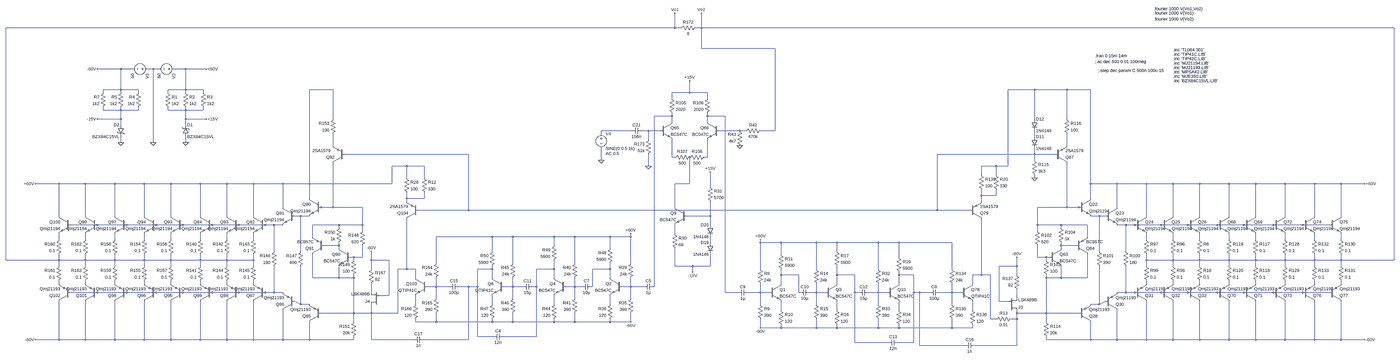
[diagram p0: schematic testV11.asc, whole sheet]
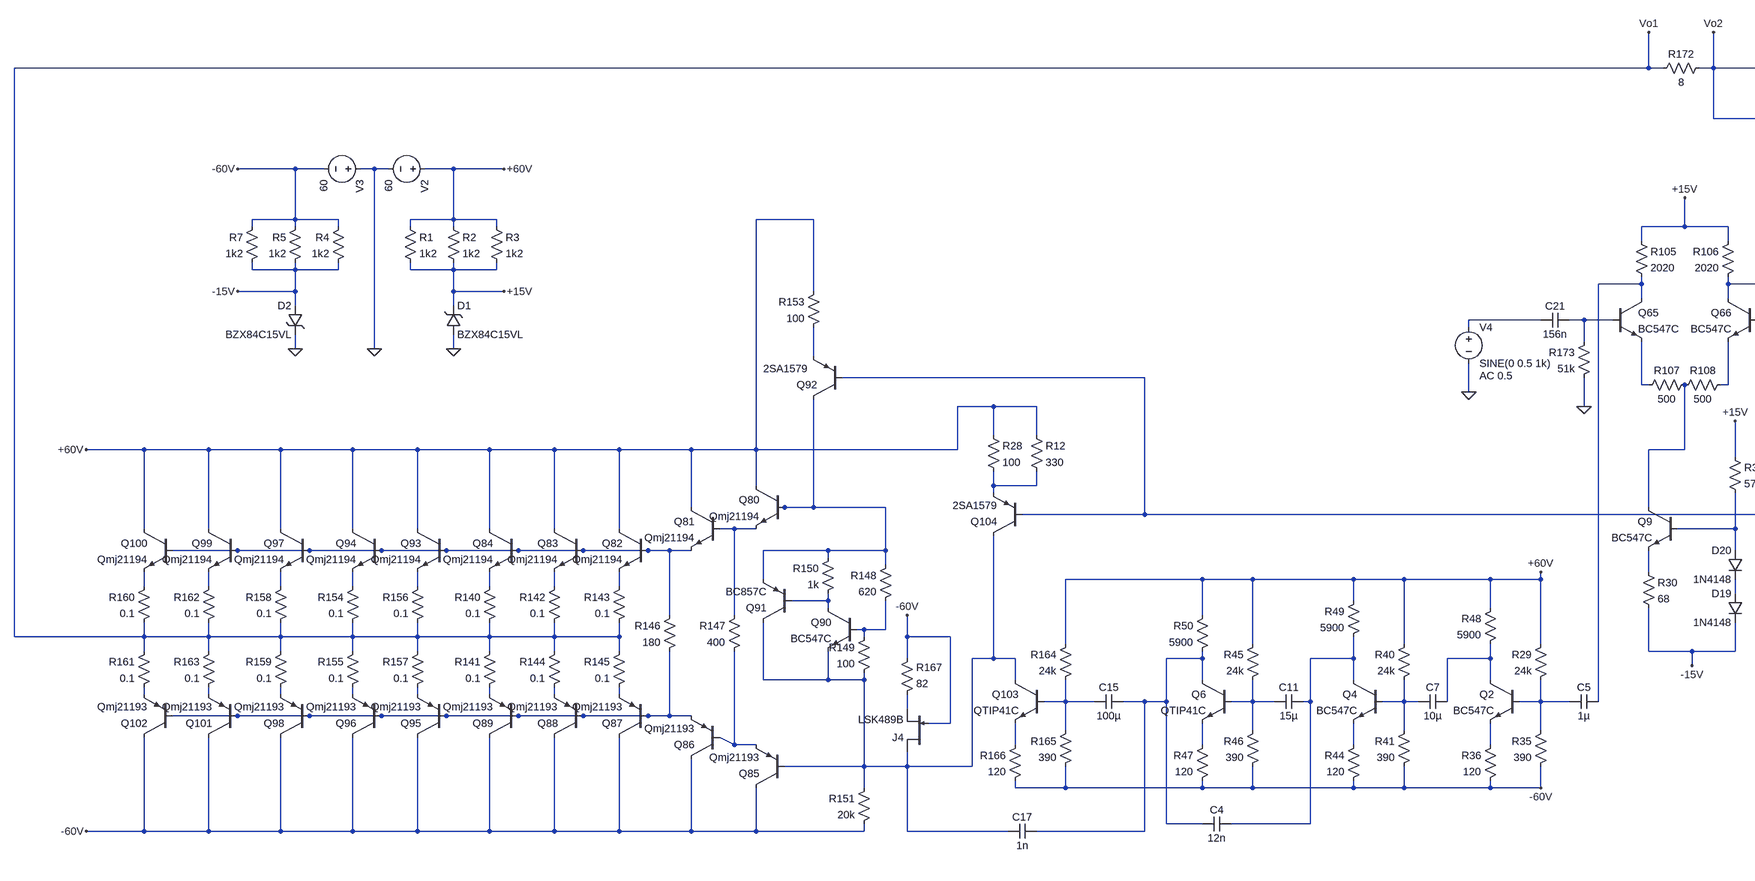
[diagram p1: schematic testV11.asc, part, row 1 of 1, column 1 of 2]
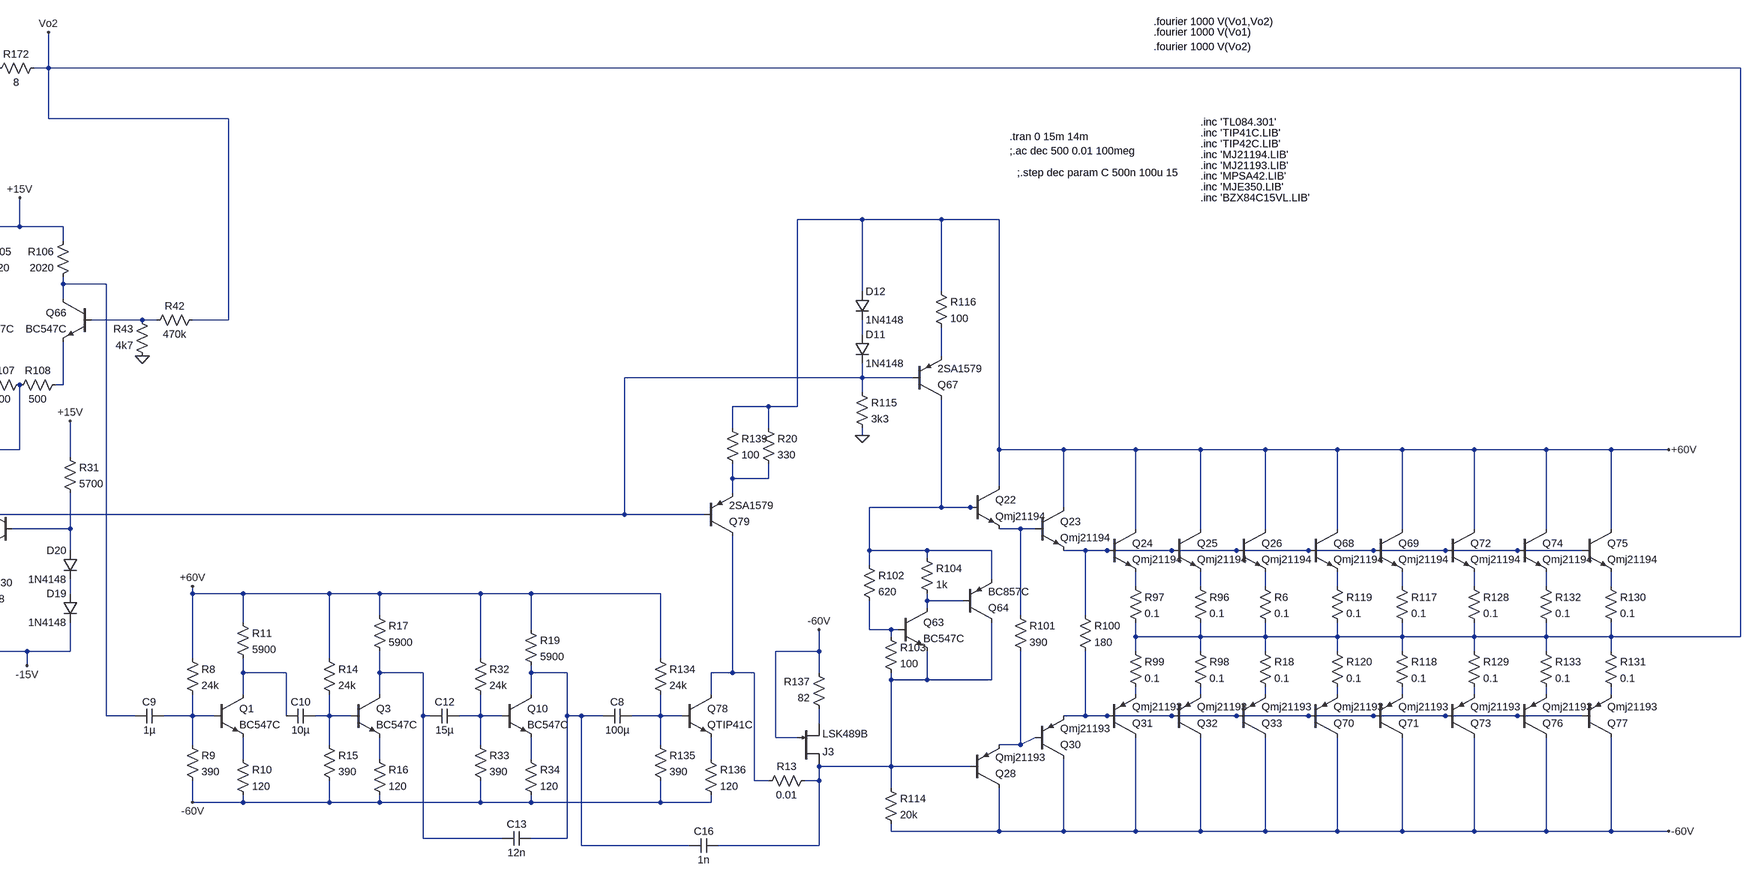
[diagram p2: schematic testV11.asc, part, row 1 of 1, column 2 of 2]
testV11.asc, the LTspice schematic file:
Version 4
SHEET 1 16980 7664
WIRE 7632 4208 7632 4128
WIRE 7632 4208 4000 4208
WIRE 7664 4208 7632 4208
WIRE 7776 4208 7776 4128
WIRE 7776 4208 7744 4208
WIRE 11536 4208 7776 4208
WIRE 7776 4320 7776 4208
WIRE 8176 4320 7776 4320
WIRE 4624 4432 4496 4432
WIRE 4688 4432 4624 4432
WIRE 4800 4432 4768 4432
WIRE 4832 4432 4800 4432
WIRE 4976 4432 4912 4432
WIRE 5088 4432 4976 4432
WIRE 4624 4544 4624 4432
WIRE 4624 4544 4528 4544
WIRE 4720 4544 4624 4544
WIRE 4976 4544 4976 4432
WIRE 4976 4544 4880 4544
WIRE 5072 4544 4976 4544
WIRE 5776 4544 5648 4544
WIRE 9584 4544 9440 4544
WIRE 9760 4544 9584 4544
WIRE 9888 4544 9760 4544
WIRE 4528 4560 4528 4544
WIRE 4624 4560 4624 4544
WIRE 4720 4560 4720 4544
WIRE 4880 4560 4880 4544
WIRE 4976 4560 4976 4544
WIRE 5072 4560 5072 4544
WIRE 7712 4560 7712 4496
WIRE 7712 4560 7616 4560
WIRE 7808 4560 7712 4560
WIRE 7616 4592 7616 4560
WIRE 7808 4592 7808 4560
WIRE 4528 4656 4528 4640
WIRE 4624 4656 4624 4640
WIRE 4624 4656 4528 4656
WIRE 4720 4656 4720 4640
WIRE 4720 4656 4624 4656
WIRE 4880 4656 4880 4640
WIRE 4976 4656 4976 4640
WIRE 4976 4656 4880 4656
WIRE 5072 4656 5072 4640
WIRE 5072 4656 4976 4656
WIRE 7616 4688 7616 4672
WIRE 7616 4688 7520 4688
WIRE 7808 4688 7808 4672
WIRE 7904 4688 7808 4688
WIRE 4624 4704 4624 4656
WIRE 4624 4704 4496 4704
WIRE 4976 4704 4976 4656
WIRE 5088 4704 4976 4704
WIRE 5776 4704 5776 4544
WIRE 9584 4704 9584 4544
WIRE 9760 4704 9760 4544
WIRE 7616 4720 7616 4688
WIRE 7808 4720 7808 4688
WIRE 4624 4736 4624 4704
WIRE 4976 4736 4976 4704
WIRE 7392 4768 7232 4768
WIRE 7488 4768 7456 4768
WIRE 7552 4768 7488 4768
WIRE 7984 4768 7872 4768
WIRE 8016 4768 7984 4768
WIRE 8176 4768 8176 4320
WIRE 8176 4768 8096 4768
WIRE 7232 4784 7232 4768
WIRE 9584 4800 9584 4768
WIRE 7488 4816 7488 4768
WIRE 4624 4832 4624 4800
WIRE 4800 4832 4800 4432
WIRE 4976 4832 4976 4800
WIRE 5776 4848 5776 4784
WIRE 9760 4848 9760 4784
WIRE 6512 4896 5840 4896
WIRE 9584 4896 9584 4864
WIRE 9584 4896 9056 4896
WIRE 9696 4896 9584 4896
WIRE 7616 4912 7616 4816
WIRE 7632 4912 7616 4912
WIRE 7808 4912 7808 4816
WIRE 7808 4912 7792 4912
WIRE 7232 4928 7232 4864
WIRE 9584 4928 9584 4896
WIRE 6176 4960 6096 4960
WIRE 6272 4960 6176 4960
WIRE 7488 4960 7488 4896
WIRE 9376 4960 9296 4960
WIRE 9440 4960 9440 4544
WIRE 9440 4960 9376 4960
WIRE 9296 5008 9296 4960
WIRE 9376 5008 9376 4960
WIRE 6176 5024 6176 4960
WIRE 6272 5024 6272 4960
WIRE 9584 5024 9584 5008
WIRE 4288 5056 4160 5056
WIRE 4432 5056 4288 5056
WIRE 4592 5056 4432 5056
WIRE 4752 5056 4592 5056
WIRE 4896 5056 4752 5056
WIRE 5056 5056 4896 5056
WIRE 5200 5056 5056 5056
WIRE 5344 5056 5200 5056
WIRE 5504 5056 5344 5056
WIRE 5648 5056 5648 4544
WIRE 5648 5056 5504 5056
WIRE 6096 5056 6096 4960
WIRE 6096 5056 5648 5056
WIRE 7712 5056 7712 4912
WIRE 7712 5056 7632 5056
WIRE 9888 5056 9888 4544
WIRE 10032 5056 9888 5056
WIRE 10192 5056 10032 5056
WIRE 10336 5056 10192 5056
WIRE 10480 5056 10336 5056
WIRE 10640 5056 10480 5056
WIRE 10784 5056 10640 5056
WIRE 10944 5056 10784 5056
WIRE 11104 5056 10944 5056
WIRE 11248 5056 11104 5056
WIRE 11376 5056 11248 5056
WIRE 7824 5072 7824 4992
WIRE 9296 5120 9296 5088
WIRE 9376 5120 9376 5088
WIRE 9376 5120 9296 5120
WIRE 5648 5136 5648 5056
WIRE 6176 5136 6176 5104
WIRE 6272 5136 6272 5104
WIRE 6272 5136 6176 5136
WIRE 9888 5136 9888 5056
WIRE 6176 5152 6176 5136
WIRE 9296 5152 9296 5120
WIRE 5504 5184 5504 5056
WIRE 5712 5184 5696 5184
WIRE 5776 5184 5776 4944
WIRE 5776 5184 5712 5184
WIRE 5936 5184 5776 5184
WIRE 7632 5184 7632 5056
WIRE 9760 5184 9760 4944
WIRE 9760 5184 9600 5184
WIRE 9824 5184 9760 5184
WIRE 9840 5184 9824 5184
WIRE 10032 5184 10032 5056
WIRE 6512 5200 6512 4896
WIRE 6512 5200 6240 5200
WIRE 9056 5200 9056 4896
WIRE 9056 5200 6512 5200
WIRE 9232 5200 9056 5200
WIRE 4288 5232 4288 5056
WIRE 4432 5232 4432 5056
WIRE 4592 5232 4592 5056
WIRE 4752 5232 4752 5056
WIRE 4896 5232 4896 5056
WIRE 5056 5232 5056 5056
WIRE 5200 5232 5200 5056
WIRE 5344 5232 5344 5056
WIRE 5600 5232 5568 5232
WIRE 5648 5232 5600 5232
WIRE 7824 5232 7824 5152
WIRE 7824 5232 7696 5232
WIRE 9936 5232 9888 5232
WIRE 9968 5232 9936 5232
WIRE 10192 5232 10192 5056
WIRE 10336 5232 10336 5056
WIRE 10480 5232 10480 5056
WIRE 10640 5232 10640 5056
WIRE 10784 5232 10784 5056
WIRE 10944 5232 10944 5056
WIRE 11104 5232 11104 5056
WIRE 11248 5232 11248 5056
WIRE 4496 5280 4352 5280
WIRE 4656 5280 4496 5280
WIRE 4816 5280 4656 5280
WIRE 4960 5280 4816 5280
WIRE 5120 5280 4960 5280
WIRE 5264 5280 5120 5280
WIRE 5408 5280 5264 5280
WIRE 5456 5280 5408 5280
WIRE 5504 5280 5456 5280
WIRE 5808 5280 5664 5280
WIRE 5936 5280 5936 5184
WIRE 5936 5280 5808 5280
WIRE 7824 5280 7824 5232
WIRE 9600 5280 9600 5184
WIRE 9728 5280 9600 5280
WIRE 9872 5280 9728 5280
WIRE 10080 5280 10032 5280
WIRE 10128 5280 10080 5280
WIRE 10272 5280 10128 5280
WIRE 10416 5280 10272 5280
WIRE 10576 5280 10416 5280
WIRE 10720 5280 10576 5280
WIRE 10880 5280 10720 5280
WIRE 11040 5280 10880 5280
WIRE 11184 5280 11040 5280
WIRE 5808 5296 5808 5280
WIRE 9728 5296 9728 5280
WIRE 5936 5312 5936 5280
WIRE 9600 5312 9600 5280
WIRE 7632 5328 7632 5280
WIRE 5664 5344 5664 5280
WIRE 6640 5344 6336 5344
WIRE 6752 5344 6640 5344
WIRE 6976 5344 6752 5344
WIRE 7088 5344 6976 5344
WIRE 7280 5344 7088 5344
WIRE 7392 5344 7392 5328
WIRE 7392 5344 7280 5344
WIRE 9872 5344 9872 5280
WIRE 4288 5360 4288 5328
WIRE 4432 5360 4432 5328
WIRE 4592 5360 4592 5328
WIRE 4752 5360 4752 5328
WIRE 4896 5360 4896 5328
WIRE 5056 5360 5056 5328
WIRE 5200 5360 5200 5328
WIRE 5344 5360 5344 5328
WIRE 10192 5360 10192 5328
WIRE 10336 5360 10336 5328
WIRE 10480 5360 10480 5328
WIRE 10640 5360 10640 5328
WIRE 10784 5360 10784 5328
WIRE 10944 5360 10944 5328
WIRE 11104 5360 11104 5328
WIRE 11248 5360 11248 5328
WIRE 7824 5376 7824 5344
WIRE 8096 5376 8096 5360
WIRE 8208 5376 8096 5376
WIRE 8400 5376 8208 5376
WIRE 8512 5376 8400 5376
WIRE 8736 5376 8512 5376
WIRE 8848 5376 8736 5376
WIRE 9136 5376 8848 5376
WIRE 5808 5392 5808 5376
WIRE 5808 5392 5728 5392
WIRE 6976 5392 6976 5344
WIRE 9728 5392 9728 5376
WIRE 9808 5392 9728 5392
WIRE 5808 5408 5808 5392
WIRE 7280 5408 7280 5344
WIRE 9728 5408 9728 5392
WIRE 5456 5424 5456 5280
WIRE 5600 5424 5600 5232
WIRE 6640 5424 6640 5344
WIRE 8512 5424 8512 5376
WIRE 9936 5424 9936 5232
WIRE 10080 5424 10080 5280
WIRE 8208 5440 8208 5376
WIRE 5888 5456 5872 5456
WIRE 5936 5456 5936 5392
WIRE 5936 5456 5888 5456
WIRE 8848 5456 8848 5376
WIRE 9600 5456 9600 5392
WIRE 9648 5456 9600 5456
WIRE 9664 5456 9648 5456
WIRE 4000 5472 4000 4208
WIRE 4288 5472 4288 5440
WIRE 4288 5472 4000 5472
WIRE 4432 5472 4432 5440
WIRE 4432 5472 4288 5472
WIRE 4592 5472 4592 5440
WIRE 4592 5472 4432 5472
WIRE 4752 5472 4752 5440
WIRE 4752 5472 4592 5472
WIRE 4896 5472 4896 5440
WIRE 4896 5472 4752 5472
WIRE 5056 5472 5056 5440
WIRE 5056 5472 4896 5472
WIRE 5200 5472 5200 5440
WIRE 5200 5472 5056 5472
WIRE 5344 5472 5344 5440
WIRE 5344 5472 5200 5472
WIRE 5888 5472 5888 5456
WIRE 5984 5472 5984 5424
WIRE 6080 5472 5984 5472
WIRE 9648 5472 9648 5456
WIRE 10192 5472 10192 5440
WIRE 10336 5472 10336 5440
WIRE 10336 5472 10192 5472
WIRE 10480 5472 10480 5440
WIRE 10480 5472 10336 5472
WIRE 10640 5472 10640 5440
WIRE 10640 5472 10480 5472
WIRE 10784 5472 10784 5440
WIRE 10784 5472 10640 5472
WIRE 10944 5472 10944 5440
WIRE 10944 5472 10784 5472
WIRE 11104 5472 11104 5440
WIRE 11104 5472 10944 5472
WIRE 11248 5472 11248 5440
WIRE 11248 5472 11104 5472
WIRE 11536 5472 11536 4208
WIRE 11536 5472 11248 5472
WIRE 6336 5488 6336 5344
WIRE 6752 5488 6752 5344
WIRE 7088 5488 7088 5344
WIRE 7392 5488 7392 5344
WIRE 4288 5504 4288 5472
WIRE 4432 5504 4432 5472
WIRE 4592 5504 4592 5472
WIRE 4752 5504 4752 5472
WIRE 4896 5504 4896 5472
WIRE 5056 5504 5056 5472
WIRE 5200 5504 5200 5472
WIRE 5344 5504 5344 5472
WIRE 7632 5504 7632 5408
WIRE 7728 5504 7632 5504
WIRE 7824 5504 7824 5440
WIRE 7824 5504 7728 5504
WIRE 9488 5504 9488 5456
WIRE 9488 5504 9392 5504
WIRE 10192 5504 10192 5472
WIRE 10336 5504 10336 5472
WIRE 10480 5504 10480 5472
WIRE 10640 5504 10640 5472
WIRE 10784 5504 10784 5472
WIRE 10944 5504 10944 5472
WIRE 11104 5504 11104 5472
WIRE 11248 5504 11248 5472
WIRE 5984 5520 5984 5472
WIRE 6176 5520 6176 5248
WIRE 6176 5520 6128 5520
WIRE 6224 5520 6176 5520
WIRE 6640 5520 6640 5504
WIRE 6640 5520 6560 5520
WIRE 6976 5520 6976 5472
WIRE 6976 5520 6880 5520
WIRE 7280 5520 7280 5488
WIRE 7280 5520 7184 5520
WIRE 8096 5520 8096 5376
WIRE 8400 5520 8400 5376
WIRE 8736 5520 8736 5376
WIRE 9136 5520 9136 5376
WIRE 7728 5536 7728 5504
WIRE 8208 5552 8208 5520
WIRE 8304 5552 8208 5552
WIRE 8512 5552 8512 5504
WIRE 8608 5552 8512 5552
WIRE 8848 5552 8848 5536
WIRE 8928 5552 8848 5552
WIRE 9296 5552 9296 5248
WIRE 9296 5552 9248 5552
WIRE 9344 5552 9296 5552
WIRE 9488 5552 9488 5504
WIRE 5664 5568 5664 5440
WIRE 5808 5568 5808 5504
WIRE 5808 5568 5664 5568
WIRE 5888 5568 5888 5552
WIRE 5888 5568 5808 5568
WIRE 6224 5568 6224 5520
WIRE 6640 5568 6640 5520
WIRE 6976 5568 6976 5520
WIRE 7280 5568 7280 5520
WIRE 9648 5568 9648 5552
WIRE 9728 5568 9728 5504
WIRE 9728 5568 9648 5568
WIRE 9872 5568 9872 5440
WIRE 9872 5568 9728 5568
WIRE 4288 5600 4288 5584
WIRE 4432 5600 4432 5584
WIRE 4592 5600 4592 5584
WIRE 4752 5600 4752 5584
WIRE 4896 5600 4896 5584
WIRE 5056 5600 5056 5584
WIRE 5200 5600 5200 5584
WIRE 5344 5600 5344 5584
WIRE 8208 5600 8208 5552
WIRE 8512 5600 8512 5552
WIRE 8848 5600 8848 5552
WIRE 9248 5600 9248 5552
WIRE 10192 5600 10192 5584
WIRE 10336 5600 10336 5584
WIRE 10480 5600 10480 5584
WIRE 10640 5600 10640 5584
WIRE 10784 5600 10784 5584
WIRE 10944 5600 10944 5584
WIRE 11104 5600 11104 5584
WIRE 11248 5600 11248 5584
WIRE 6336 5616 6336 5568
WIRE 6336 5616 6288 5616
WIRE 6400 5616 6336 5616
WIRE 6512 5616 6464 5616
WIRE 6560 5616 6560 5520
WIRE 6560 5616 6512 5616
WIRE 6752 5616 6752 5568
WIRE 6752 5616 6704 5616
WIRE 6800 5616 6752 5616
WIRE 6880 5616 6880 5520
WIRE 6880 5616 6864 5616
WIRE 7088 5616 7088 5568
WIRE 7088 5616 7040 5616
WIRE 7120 5616 7088 5616
WIRE 7184 5616 7184 5520
WIRE 7392 5616 7392 5568
WIRE 7392 5616 7344 5616
WIRE 7456 5616 7392 5616
WIRE 7520 5616 7520 4688
WIRE 5984 5632 5984 5600
WIRE 4496 5648 4352 5648
WIRE 4656 5648 4496 5648
WIRE 4816 5648 4656 5648
WIRE 4960 5648 4816 5648
WIRE 5120 5648 4960 5648
WIRE 5264 5648 5120 5648
WIRE 5408 5648 5264 5648
WIRE 5456 5648 5456 5504
WIRE 5456 5648 5408 5648
WIRE 5504 5648 5456 5648
WIRE 7904 5648 7904 4688
WIRE 7968 5648 7904 5648
WIRE 8096 5648 8096 5600
WIRE 8096 5648 8032 5648
WIRE 8144 5648 8096 5648
WIRE 8304 5648 8304 5552
WIRE 8400 5648 8400 5600
WIRE 8400 5648 8368 5648
WIRE 8448 5648 8400 5648
WIRE 8608 5648 8608 5552
WIRE 8624 5648 8608 5648
WIRE 8736 5648 8736 5600
WIRE 8736 5648 8688 5648
WIRE 8784 5648 8736 5648
WIRE 8928 5648 8928 5552
WIRE 8960 5648 8928 5648
WIRE 9008 5648 8960 5648
WIRE 9136 5648 9136 5600
WIRE 9136 5648 9072 5648
WIRE 9184 5648 9136 5648
WIRE 10080 5648 10080 5504
WIRE 10080 5648 10032 5648
WIRE 10128 5648 10080 5648
WIRE 10272 5648 10128 5648
WIRE 10416 5648 10272 5648
WIRE 10576 5648 10416 5648
WIRE 10720 5648 10576 5648
WIRE 10880 5648 10720 5648
WIRE 11040 5648 10880 5648
WIRE 11184 5648 11040 5648
WIRE 6080 5664 6080 5472
WIRE 6080 5664 6032 5664
WIRE 9488 5664 9488 5632
WIRE 6336 5680 6336 5616
WIRE 6752 5680 6752 5616
WIRE 7088 5680 7088 5616
WIRE 7392 5680 7392 5616
WIRE 9392 5696 9392 5504
WIRE 9440 5696 9392 5696
WIRE 5600 5712 5600 5504
WIRE 5600 5712 5568 5696
WIRE 5648 5712 5600 5712
WIRE 6224 5712 6224 5664
WIRE 6640 5712 6640 5664
WIRE 6976 5712 6976 5664
WIRE 7280 5712 7280 5664
WIRE 8096 5712 8096 5648
WIRE 8400 5712 8400 5648
WIRE 8736 5712 8736 5648
WIRE 9136 5712 9136 5648
WIRE 9936 5712 9936 5504
WIRE 9936 5712 9968 5696
WIRE 9936 5712 9888 5712
WIRE 8208 5744 8208 5696
WIRE 8512 5744 8512 5696
WIRE 8848 5744 8848 5696
WIRE 9248 5744 9248 5696
WIRE 5888 5760 5888 5568
WIRE 5888 5760 5712 5760
WIRE 5984 5760 5984 5728
WIRE 5984 5760 5888 5760
WIRE 6128 5760 6128 5520
WIRE 6128 5760 5984 5760
WIRE 9648 5760 9648 5568
WIRE 9648 5760 9488 5760
WIRE 9824 5760 9648 5760
WIRE 9344 5792 9344 5552
WIRE 9376 5792 9344 5792
WIRE 9488 5792 9488 5760
WIRE 9488 5792 9456 5792
WIRE 5888 5808 5888 5760
WIRE 6224 5808 6224 5792
WIRE 6336 5808 6336 5760
WIRE 6336 5808 6224 5808
WIRE 6640 5808 6640 5792
WIRE 6640 5808 6336 5808
WIRE 6752 5808 6752 5760
WIRE 6752 5808 6640 5808
WIRE 6976 5808 6976 5792
WIRE 6976 5808 6752 5808
WIRE 7088 5808 7088 5760
WIRE 7088 5808 6976 5808
WIRE 7280 5808 7280 5792
WIRE 7280 5808 7088 5808
WIRE 7392 5808 7392 5760
WIRE 7392 5808 7280 5808
WIRE 9648 5808 9648 5760
WIRE 8096 5840 8096 5792
WIRE 8208 5840 8208 5824
WIRE 8208 5840 8096 5840
WIRE 8400 5840 8400 5792
WIRE 8400 5840 8208 5840
WIRE 8512 5840 8512 5824
WIRE 8512 5840 8400 5840
WIRE 8736 5840 8736 5792
WIRE 8736 5840 8512 5840
WIRE 8848 5840 8848 5824
WIRE 8848 5840 8736 5840
WIRE 9136 5840 9136 5792
WIRE 9136 5840 8848 5840
WIRE 9248 5840 9248 5824
WIRE 9248 5840 9136 5840
WIRE 6560 5888 6560 5616
WIRE 6640 5888 6560 5888
WIRE 6880 5888 6880 5616
WIRE 6880 5888 6704 5888
WIRE 4288 5904 4288 5696
WIRE 4288 5904 4160 5904
WIRE 4432 5904 4432 5696
WIRE 4432 5904 4288 5904
WIRE 4592 5904 4592 5696
WIRE 4592 5904 4432 5904
WIRE 4752 5904 4752 5696
WIRE 4752 5904 4592 5904
WIRE 4896 5904 4896 5696
WIRE 4896 5904 4752 5904
WIRE 5056 5904 5056 5696
WIRE 5056 5904 4896 5904
WIRE 5200 5904 5200 5696
WIRE 5200 5904 5056 5904
WIRE 5344 5904 5344 5696
WIRE 5344 5904 5200 5904
WIRE 5504 5904 5504 5744
WIRE 5504 5904 5344 5904
WIRE 5648 5904 5648 5808
WIRE 5648 5904 5504 5904
WIRE 5888 5904 5888 5888
WIRE 5888 5904 5648 5904
WIRE 5984 5904 5984 5760
WIRE 6208 5904 5984 5904
WIRE 6512 5904 6512 5616
WIRE 6512 5904 6272 5904
WIRE 9648 5904 9648 5888
WIRE 9888 5904 9888 5808
WIRE 9888 5904 9648 5904
WIRE 10032 5904 10032 5744
WIRE 10032 5904 9888 5904
WIRE 10192 5904 10192 5696
WIRE 10192 5904 10032 5904
WIRE 10336 5904 10336 5696
WIRE 10336 5904 10192 5904
WIRE 10480 5904 10480 5696
WIRE 10480 5904 10336 5904
WIRE 10640 5904 10640 5696
WIRE 10640 5904 10480 5904
WIRE 10784 5904 10784 5696
WIRE 10784 5904 10640 5904
WIRE 10944 5904 10944 5696
WIRE 10944 5904 10784 5904
WIRE 11104 5904 11104 5696
WIRE 11104 5904 10944 5904
WIRE 11248 5904 11248 5696
WIRE 11248 5904 11104 5904
WIRE 11376 5904 11248 5904
WIRE 8608 5920 8608 5648
WIRE 8784 5920 8608 5920
WIRE 8928 5920 8928 5648
WIRE 8928 5920 8848 5920
WIRE 8960 5936 8960 5648
WIRE 9200 5936 8960 5936
WIRE 9488 5936 9488 5792
WIRE 9488 5936 9264 5936
FLAG 4800 4832 0
FLAG 5088 4432 +60V
FLAG 4496 4432 -60V
FLAG 7712 4496 +15V
FLAG 9584 5024 0
FLAG 11376 5904 -60V
FLAG 11376 5056 +60V
FLAG 4160 5904 -60V
FLAG 4160 5056 +60V
FLAG 7232 4928 0
FLAG 7488 4960 0
FLAG 9488 5456 -60V
FLAG 5984 5424 -60V
FLAG 4976 4832 0
FLAG 4624 4832 0
FLAG 5088 4704 +15V
FLAG 4496 4704 -15V
FLAG 7632 4128 Vo1
FLAG 7776 4128 Vo2
FLAG 7728 5536 -15V
FLAG 7824 4992 +15V
FLAG 8096 5360 +60V
FLAG 8096 5840 -60V
FLAG 7984 4848 0
FLAG 7392 5328 +60V
FLAG 7392 5808 -60V
SYMBOL voltage 4928 4432 R90
WINDOW 123 0 0 Left 0
WINDOW 39 24 44 Left 2
SYMATTR InstName V2
SYMATTR Value 60
SYMBOL voltage 4784 4432 R90
WINDOW 123 0 0 Left 0
WINDOW 39 24 124 Left 2
SYMATTR InstName V3
SYMATTR Value 60
SYMBOL npn 9824 5136 R0
SYMATTR InstName Q22
SYMATTR Value Qmj21194
SYMBOL npn 9968 5184 R0
SYMATTR InstName Q23
SYMATTR Value Qmj21194
SYMBOL npn 10128 5232 R0
SYMATTR InstName Q24
SYMATTR Value Qmj21194
SYMBOL npn 10272 5232 R0
SYMATTR InstName Q25
SYMATTR Value Qmj21194
SYMBOL npn 10416 5232 R0
SYMATTR InstName Q26
SYMATTR Value Qmj21194
SYMBOL pnp 9824 5808 M180
SYMATTR InstName Q28
SYMATTR Value Qmj21193
SYMBOL pnp 9968 5744 M180
SYMATTR InstName Q30
SYMATTR Value Qmj21193
SYMBOL pnp 10128 5696 M180
SYMATTR InstName Q31
SYMATTR Value Qmj21193
SYMBOL pnp 10272 5696 M180
SYMATTR InstName Q32
SYMATTR Value Qmj21193
SYMBOL pnp 10416 5696 M180
SYMATTR InstName Q33
SYMATTR Value Qmj21193
SYMBOL res 10464 5344 R0
SYMATTR InstName R6
SYMATTR Value 0.1
SYMBOL res 10464 5488 R0
SYMATTR InstName R18
SYMATTR Value 0.1
SYMBOL res 10320 5344 R0
SYMATTR InstName R96
SYMATTR Value 0.1
SYMBOL res 10176 5344 R0
SYMATTR InstName R97
SYMATTR Value 0.1
SYMBOL res 10320 5488 R0
SYMATTR InstName R98
SYMATTR Value 0.1
SYMBOL res 10176 5488 R0
SYMATTR InstName R99
SYMATTR Value 0.1
SYMBOL res 10064 5408 R0
SYMATTR InstName R100
SYMATTR Value 180
SYMBOL res 9920 5408 R0
SYMATTR InstName R101
SYMATTR Value 390
SYMBOL npn 9664 5408 R0
SYMATTR InstName Q63
SYMATTR Value BC547C
SYMBOL res 9584 5296 R0
SYMATTR InstName R102
SYMATTR Value 620
SYMBOL res 9632 5456 R0
SYMATTR InstName R103
SYMATTR Value 100
SYMBOL res 9712 5280 R0
SYMATTR InstName R104
SYMATTR Value 1k
SYMBOL pnp 9808 5440 M180
SYMATTR InstName Q64
SYMATTR Value BC857C
SYMBOL npn 7552 4720 R0
SYMATTR InstName Q65
SYMATTR Value BC547C
SYMBOL npn 7872 4720 M0
SYMATTR InstName Q66
SYMATTR Value BC547C
SYMBOL res 7600 4576 R0
SYMATTR InstName R105
SYMATTR Value 2020
SYMBOL res 7824 4576 M0
SYMATTR InstName R106
SYMATTR Value 2020
SYMBOL res 7728 4896 R90
WINDOW 0 0 56 VBottom 2
WINDOW 3 32 56 VTop 2
SYMATTR InstName R107
SYMATTR Value 500
SYMBOL res 7808 4896 R90
WINDOW 0 0 56 VBottom 2
WINDOW 3 32 56 VTop 2
SYMATTR InstName R108
SYMATTR Value 500
SYMBOL res 9632 5792 R0
SYMATTR InstName R114
SYMATTR Value 20k
SYMBOL pnp 9696 4944 M180
SYMATTR InstName Q67
SYMATTR Value 2SA1579
SYMBOL res 9568 4912 R0
SYMATTR InstName R115
SYMATTR Value 3k3
SYMBOL diode 9568 4800 R0
SYMATTR InstName D11
SYMATTR Value 1N4148
SYMBOL diode 9568 4704 R0
SYMATTR InstName D12
SYMATTR Value 1N4148
SYMBOL res 9744 4688 R0
SYMATTR InstName R116
SYMATTR Value 100
SYMBOL npn 10576 5232 R0
SYMATTR InstName Q68
SYMATTR Value Qmj21194
SYMBOL npn 10720 5232 R0
SYMATTR InstName Q69
SYMATTR Value Qmj21194
SYMBOL pnp 10576 5696 M180
SYMATTR InstName Q70
SYMATTR Value Qmj21193
SYMBOL pnp 10720 5696 M180
SYMATTR InstName Q71
SYMATTR Value Qmj21193
SYMBOL res 10768 5344 R0
SYMATTR InstName R117
SYMATTR Value 0.1
SYMBOL res 10768 5488 R0
SYMATTR InstName R118
SYMATTR Value 0.1
SYMBOL res 10624 5344 R0
SYMATTR InstName R119
SYMATTR Value 0.1
SYMBOL res 10624 5488 R0
SYMATTR InstName R120
SYMATTR Value 0.1
SYMBOL npn 10880 5232 R0
SYMATTR InstName Q72
SYMATTR Value Qmj21194
SYMBOL pnp 10880 5696 M180
SYMATTR InstName Q73
SYMATTR Value Qmj21193
SYMBOL res 10928 5344 R0
SYMATTR InstName R128
SYMATTR Value 0.1
SYMBOL res 10928 5488 R0
SYMATTR InstName R129
SYMATTR Value 0.1
SYMBOL npn 11040 5232 R0
SYMATTR InstName Q74
SYMATTR Value Qmj21194
SYMBOL npn 11184 5232 R0
SYMATTR InstName Q75
SYMATTR Value Qmj21194
SYMBOL pnp 11040 5696 M180
SYMATTR InstName Q76
SYMATTR Value Qmj21193
SYMBOL pnp 11184 5696 M180
SYMATTR InstName Q77
SYMATTR Value Qmj21193
SYMBOL res 11232 5344 R0
SYMATTR InstName R130
SYMATTR Value 0.1
SYMBOL res 11232 5488 R0
SYMATTR InstName R131
SYMATTR Value 0.1
SYMBOL res 11088 5344 R0
SYMATTR InstName R132
SYMATTR Value 0.1
SYMBOL res 11088 5488 R0
SYMATTR InstName R133
SYMATTR Value 0.1
SYMBOL res 9120 5504 R0
SYMATTR InstName R134
SYMATTR Value 24k
SYMBOL res 9120 5696 R0
SYMATTR InstName R135
SYMATTR Value 390
SYMBOL npn 9184 5600 R0
SYMATTR InstName Q78
SYMATTR Value QTIP41C
SYMBOL res 9232 5728 R0
SYMATTR InstName R136
SYMATTR Value 120
SYMBOL njf 9440 5760 M180
SYMATTR InstName J3
SYMATTR Value LSK489B
SYMBOL res 9504 5648 R180
WINDOW 0 36 76 Left 2
WINDOW 3 36 40 Left 2
SYMATTR InstName R137
SYMATTR Value 82
SYMBOL pnp 9232 5248 M180
SYMATTR InstName Q79
SYMATTR Value 2SA1579
SYMBOL res 9280 4992 R0
SYMATTR InstName R139
SYMATTR Value 100
SYMBOL cap 9264 5920 R90
WINDOW 0 0 32 VBottom 2
WINDOW 3 32 32 VTop 2
SYMATTR InstName C16
SYMATTR Value 1n
SYMATTR SpiceLine Rser=0.1
SYMBOL npn 5712 5136 M0
SYMATTR InstName Q80
SYMATTR Value Qmj21194
SYMBOL npn 5568 5184 M0
SYMATTR InstName Q81
SYMATTR Value Qmj21194
SYMBOL npn 5408 5232 M0
SYMATTR InstName Q82
SYMATTR Value Qmj21194
SYMBOL npn 5264 5232 M0
SYMATTR InstName Q83
SYMATTR Value Qmj21194
SYMBOL npn 5120 5232 M0
SYMATTR InstName Q84
SYMATTR Value Qmj21194
SYMBOL pnp 5712 5808 R180
SYMATTR InstName Q85
SYMATTR Value Qmj21193
SYMBOL pnp 5568 5744 R180
SYMATTR InstName Q86
SYMATTR Value Qmj21193
SYMBOL pnp 5408 5696 R180
SYMATTR InstName Q87
SYMATTR Value Qmj21193
SYMBOL pnp 5264 5696 R180
SYMATTR InstName Q88
SYMATTR Value Qmj21193
SYMBOL pnp 5120 5696 R180
SYMATTR InstName Q89
SYMATTR Value Qmj21193
SYMBOL res 5072 5344 M0
SYMATTR InstName R140
SYMATTR Value 0.1
SYMBOL res 5072 5488 M0
SYMATTR InstName R141
SYMATTR Value 0.1
SYMBOL res 5216 5344 M0
SYMATTR InstName R142
SYMATTR Value 0.1
SYMBOL res 5360 5344 M0
SYMATTR InstName R143
SYMATTR Value 0.1
SYMBOL res 5216 5488 M0
SYMATTR InstName R144
SYMATTR Value 0.1
SYMBOL res 5360 5488 M0
SYMATTR InstName R145
SYMATTR Value 0.1
SYMBOL res 5472 5408 M0
SYMATTR InstName R146
SYMATTR Value 180
SYMBOL res 5616 5408 M0
SYMATTR InstName R147
SYMATTR Value 400
SYMBOL npn 5872 5408 M0
SYMATTR InstName Q90
SYMATTR Value BC547C
SYMBOL res 5952 5296 M0
SYMATTR InstName R148
SYMATTR Value 620
SYMBOL res 5904 5456 M0
SYMATTR InstName R149
SYMATTR Value 100
SYMBOL res 5824 5280 M0
SYMATTR InstName R150
SYMATTR Value 1k
SYMBOL pnp 5728 5440 R180
SYMATTR InstName Q91
SYMATTR Value BC857C
SYMBOL res 5904 5792 M0
SYMATTR InstName R151
SYMATTR Value 20k
SYMBOL pnp 5840 4944 R180
WINDOW 3 77 68 Left 2
SYMATTR Value 2SA1579
SYMATTR InstName Q92
SYMBOL res 5792 4688 M0
SYMATTR InstName R153
SYMATTR Value 100
SYMBOL npn 4960 5232 M0
SYMATTR InstName Q93
SYMATTR Value Qmj21194
SYMBOL npn 4816 5232 M0
SYMATTR InstName Q94
SYMATTR Value Qmj21194
SYMBOL pnp 4960 5696 R180
SYMATTR InstName Q95
SYMATTR Value Qmj21193
SYMBOL pnp 4816 5696 R180
SYMATTR InstName Q96
SYMATTR Value Qmj21193
SYMBOL res 4768 5344 M0
SYMATTR InstName R154
SYMATTR Value 0.1
SYMBOL res 4768 5488 M0
SYMATTR InstName R155
SYMATTR Value 0.1
SYMBOL res 4912 5344 M0
SYMATTR InstName R156
SYMATTR Value 0.1
SYMBOL res 4912 5488 M0
SYMATTR InstName R157
SYMATTR Value 0.1
SYMBOL npn 4656 5232 M0
SYMATTR InstName Q97
SYMATTR Value Qmj21194
SYMBOL pnp 4656 5696 R180
SYMATTR InstName Q98
SYMATTR Value Qmj21193
SYMBOL res 4608 5344 M0
SYMATTR InstName R158
SYMATTR Value 0.1
SYMBOL res 4608 5488 M0
SYMATTR InstName R159
SYMATTR Value 0.1
SYMBOL npn 4496 5232 M0
SYMATTR InstName Q99
SYMATTR Value Qmj21194
SYMBOL npn 4352 5232 M0
SYMATTR InstName Q100
SYMATTR Value Qmj21194
SYMBOL pnp 4496 5696 R180
SYMATTR InstName Q101
SYMATTR Value Qmj21193
SYMBOL pnp 4352 5696 R180
SYMATTR InstName Q102
SYMATTR Value Qmj21193
SYMBOL res 4304 5344 M0
SYMATTR InstName R160
SYMATTR Value 0.1
SYMBOL res 4304 5488 M0
SYMATTR InstName R161
SYMATTR Value 0.1
SYMBOL res 4448 5344 M0
SYMATTR InstName R162
SYMATTR Value 0.1
SYMBOL res 4448 5488 M0
SYMATTR InstName R163
SYMATTR Value 0.1
SYMBOL res 6352 5472 M0
SYMATTR InstName R164
SYMATTR Value 24k
SYMBOL res 6352 5664 M0
SYMATTR InstName R165
SYMATTR Value 390
SYMBOL npn 6288 5568 M0
SYMATTR InstName Q103
SYMATTR Value QTIP41C
SYMBOL res 6240 5696 M0
SYMATTR InstName R166
SYMATTR Value 120
SYMBOL njf 6032 5728 R180
SYMATTR InstName J4
SYMATTR Value LSK489B
SYMBOL res 5968 5616 M180
WINDOW 0 36 76 Left 2
WINDOW 3 36 40 Left 2
SYMATTR InstName R167
SYMATTR Value 82
SYMBOL pnp 6240 5248 R180
SYMATTR InstName Q104
SYMATTR Value 2SA1579
SYMBOL cap 6208 5888 M90
WINDOW 0 0 32 VBottom 2
WINDOW 3 32 32 VTop 2
SYMATTR InstName C17
SYMATTR Value 1n
SYMATTR SpiceLine Rser=0.1
SYMBOL voltage 7232 4768 R0
WINDOW 123 24 124 Left 2
WINDOW 39 0 0 Left 0
SYMATTR Value2 AC 0.5
SYMATTR InstName V4
SYMATTR Value SINE(0 0.5 1k)
SYMBOL cap 7456 4752 R90
WINDOW 0 0 32 VBottom 2
WINDOW 3 32 32 VTop 2
SYMATTR InstName C21
SYMATTR Value 156n
SYMATTR SpiceLine Rser=0.1
SYMBOL res 7504 4800 M0
SYMATTR InstName R173
SYMATTR Value 51k
SYMBOL res 7760 4192 R90
WINDOW 0 0 56 VBottom 2
WINDOW 3 32 56 VTop 2
SYMATTR InstName R172
SYMATTR Value 8
SYMBOL res 4864 4544 R0
SYMATTR InstName R1
SYMATTR Value 1k2
SYMBOL res 4960 4544 R0
SYMATTR InstName R2
SYMATTR Value 1k2
SYMBOL res 5056 4544 R0
SYMATTR InstName R3
SYMATTR Value 1k2
SYMBOL res 4736 4544 M0
SYMATTR InstName R4
SYMATTR Value 1k2
SYMBOL res 4640 4544 M0
SYMATTR InstName R5
SYMATTR Value 1k2
SYMBOL res 4544 4544 M0
SYMATTR InstName R7
SYMATTR Value 1k2
SYMBOL zener 4960 4800 M180
WINDOW 0 24 64 Left 2
WINDOW 3 24 0 Left 2
SYMATTR InstName D1
SYMATTR Value BZX84C15VL
SYMBOL zener 4640 4736 M0
SYMATTR InstName D2
SYMATTR Value BZX84C15VL
SYMBOL res 9472 5776 R90
WINDOW 0 0 56 VBottom 2
WINDOW 3 32 56 VTop 2
SYMATTR InstName R13
SYMATTR Value 0.01
SYMBOL diode 7840 5376 M0
SYMATTR InstName D19
SYMATTR Value 1N4148
SYMBOL diode 7840 5280 M0
SYMATTR InstName D20
SYMATTR Value 1N4148
SYMBOL npn 7696 5184 M0
SYMATTR InstName Q9
SYMATTR Value BC547C
SYMBOL res 7616 5312 R0
SYMATTR InstName R30
SYMATTR Value 68
SYMBOL res 7808 5056 R0
SYMATTR InstName R31
SYMATTR Value 5700
SYMBOL res 8080 5504 R0
SYMATTR InstName R8
SYMATTR Value 24k
SYMBOL res 8080 5696 R0
SYMATTR InstName R9
SYMATTR Value 390
SYMBOL npn 8144 5600 R0
SYMATTR InstName Q1
SYMATTR Value BC547C
SYMBOL res 8192 5728 R0
SYMATTR InstName R10
SYMATTR Value 120
SYMBOL res 8384 5504 R0
SYMATTR InstName R14
SYMATTR Value 24k
SYMBOL res 8384 5696 R0
SYMATTR InstName R15
SYMATTR Value 390
SYMBOL npn 8448 5600 R0
SYMATTR InstName Q3
SYMATTR Value BC547C
SYMBOL res 8496 5728 R0
SYMATTR InstName R16
SYMATTR Value 120
SYMBOL res 8720 5504 R0
SYMATTR InstName R32
SYMATTR Value 24k
SYMBOL res 8720 5696 R0
SYMATTR InstName R33
SYMATTR Value 390
SYMBOL npn 8784 5600 R0
SYMATTR InstName Q10
SYMATTR Value BC547C
SYMBOL res 8832 5728 R0
SYMATTR InstName R34
SYMATTR Value 120
SYMBOL res 8112 4752 R90
WINDOW 0 0 56 VBottom 2
WINDOW 3 32 56 VTop 2
SYMATTR InstName R42
SYMATTR Value 470k
SYMBOL res 8000 4864 R180
WINDOW 0 36 76 Left 2
WINDOW 3 36 40 Left 2
SYMATTR InstName R43
SYMATTR Value 4k7
SYMBOL res 8192 5424 R0
SYMATTR InstName R11
SYMATTR Value 5900
SYMBOL res 8496 5408 R0
SYMATTR InstName R17
SYMATTR Value 5900
SYMBOL res 8832 5440 R0
SYMATTR InstName R19
SYMATTR Value 5900
SYMBOL res 6160 5008 R0
SYMATTR InstName R28
SYMATTR Value 100
SYMBOL cap 8784 5904 M90
WINDOW 0 0 32 VBottom 2
WINDOW 3 32 32 VTop 2
SYMATTR InstName C13
SYMATTR Value 12n
SYMATTR SpiceLine Rser=0.1
SYMBOL cap 9008 5632 M90
WINDOW 0 0 32 VBottom 2
WINDOW 3 32 32 VTop 2
SYMATTR InstName C8
SYMATTR Value 100µ
SYMATTR SpiceLine Rser=0.1
SYMBOL cap 6400 5600 M90
WINDOW 0 0 32 VBottom 2
WINDOW 3 32 32 VTop 2
SYMATTR InstName C15
SYMATTR Value 100µ
SYMATTR SpiceLine Rser=0.1
SYMBOL cap 8032 5632 R90
WINDOW 0 0 32 VBottom 2
WINDOW 3 32 32 VTop 2
SYMATTR InstName C9
SYMATTR Value 1µ
SYMBOL cap 8368 5632 R90
WINDOW 0 0 32 VBottom 2
WINDOW 3 32 32 VTop 2
SYMATTR InstName C10
SYMATTR Value 10µ
SYMBOL cap 8688 5632 R90
WINDOW 0 0 32 VBottom 2
WINDOW 3 32 32 VTop 2
SYMATTR InstName C12
SYMATTR Value 15µ
SYMBOL res 7408 5472 M0
SYMATTR InstName R29
SYMATTR Value 24k
SYMBOL res 7408 5664 M0
SYMATTR InstName R35
SYMATTR Value 390
SYMBOL npn 7344 5568 M0
SYMATTR InstName Q2
SYMATTR Value BC547C
SYMBOL res 7296 5696 M0
SYMATTR InstName R36
SYMATTR Value 120
SYMBOL res 7104 5472 M0
SYMATTR InstName R40
SYMATTR Value 24k
SYMBOL res 7104 5664 M0
SYMATTR InstName R41
SYMATTR Value 390
SYMBOL npn 7040 5568 M0
SYMATTR InstName Q4
SYMATTR Value BC547C
SYMBOL res 6992 5696 M0
SYMATTR InstName R44
SYMATTR Value 120
SYMBOL res 6768 5472 M0
SYMATTR InstName R45
SYMATTR Value 24k
SYMBOL res 6768 5664 M0
SYMATTR InstName R46
SYMATTR Value 390
SYMBOL npn 6704 5568 M0
SYMATTR InstName Q6
SYMATTR Value QTIP41C
SYMBOL res 6656 5696 M0
SYMATTR InstName R47
SYMATTR Value 120
SYMBOL res 7296 5392 M0
SYMATTR InstName R48
SYMATTR Value 5900
SYMBOL res 6992 5376 M0
SYMATTR InstName R49
SYMATTR Value 5900
SYMBOL res 6656 5408 M0
SYMATTR InstName R50
SYMATTR Value 5900
SYMBOL cap 6704 5872 R90
WINDOW 0 0 32 VBottom 2
WINDOW 3 32 32 VTop 2
SYMATTR InstName C4
SYMATTR Value 12n
SYMATTR SpiceLine Rser=0.1
SYMBOL cap 7456 5600 M90
WINDOW 0 0 32 VBottom 2
WINDOW 3 32 32 VTop 2
SYMATTR InstName C5
SYMATTR Value 1µ
SYMBOL cap 7120 5600 M90
WINDOW 0 0 32 VBottom 2
WINDOW 3 32 32 VTop 2
SYMATTR InstName C7
SYMATTR Value 10µ
SYMBOL cap 6800 5600 M90
WINDOW 0 0 32 VBottom 2
WINDOW 3 32 32 VTop 2
SYMATTR InstName C11
SYMATTR Value 15µ
SYMBOL res 6256 5008 R0
SYMATTR InstName R12
SYMATTR Value 330
SYMBOL res 9360 4992 R0
SYMATTR InstName R20
SYMATTR Value 330
TEXT 10336 4328 Left 2 !.inc 'TL084.301'
TEXT 10336 4352 Left 2 !.inc 'TIP41C.LIB'
TEXT 10336 4376 Left 2 !.inc 'TIP42C.LIB'
TEXT 10336 4400 Left 2 !.inc 'MJ21194.LIB'
TEXT 10336 4424 Left 2 !.inc 'MJ21193.LIB'
TEXT 10336 4448 Left 2 !.inc 'MPSA42.LIB'
TEXT 10336 4472 Left 2 !.inc 'MJE350.LIB'
TEXT 10336 4496 Left 2 !.inc 'BZX84C15VL.LIB'
TEXT 9912 4360 Left 2 !.tran 0 15m 14m
TEXT 9912 4392 Left 2 !;.ac dec 500 0.01 100meg
TEXT 10232 4104 Left 2 !.fourier 1000 V(Vo1,Vo2)
TEXT 10232 4128 Left 2 !.fourier 1000 V(Vo1)
TEXT 10232 4160 Left 2 !.fourier 1000 V(Vo2)
TEXT 9928 4440 Left 2 !;.step dec param C 500n 100u 15

The netlist it stands for:
* testV11.asc
V2 +60V 0 60
V3 0 -60V 60
Q22 +60V N016 N019 0 Qmj21194
Q23 +60V N019 N021 0 Qmj21194
Q24 +60V N021 N031 0 Qmj21194
Q25 +60V N021 N032 0 Qmj21194
Q26 +60V N021 N033 0 Qmj21194
Q28 -60V N052 N086 0 Qmj21193
Q30 -60V N086 N079 0 Qmj21193
Q31 -60V N079 N061 0 Qmj21193
Q32 -60V N079 N062 0 Qmj21193
Q33 -60V N079 N063 0 Qmj21193
R6 N033 Vo2 0.1
R18 Vo2 N063 0.1
R96 N032 Vo2 0.1
R97 N031 Vo2 0.1
R98 Vo2 N062 0.1
R99 Vo2 N061 0.1
R100 N021 N079 180
R101 N019 N086 390
Q63 N041 N043 N052 0 BC547C
R102 N016 N043 620
R103 N043 N052 100
R104 N016 N041 1k
Q64 N052 N041 N016 0 BC857C
Q65 N001 N004 N010 0 BC547C
Q66 N002 N005 N011 0 BC547C
R105 +15V N001 2020
R106 +15V N002 2020
R107 N012 N010 500
R108 N011 N012 500
R114 N052 -60V 20k
Q67 N016 N009 N008 0 2SA1579
R115 N009 0 3k3
D11 N006 N009 1N4148
D12 +60V N006 1N4148
R116 +60V N008 100
Q68 +60V N021 N034 0 Qmj21194
Q69 +60V N021 N035 0 Qmj21194
Q70 -60V N079 N064 0 Qmj21193
Q71 -60V N079 N065 0 Qmj21193
R117 N035 Vo2 0.1
R118 Vo2 N065 0.1
R119 N034 Vo2 0.1
R120 Vo2 N064 0.1
Q72 +60V N021 N036 0 Qmj21194
Q73 -60V N079 N066 0 Qmj21193
R128 N036 Vo2 0.1
R129 Vo2 N066 0.1
Q74 +60V N021 N037 0 Qmj21194
Q75 +60V N021 N038 0 Qmj21194
Q76 -60V N079 N067 0 Qmj21193
Q77 -60V N079 N068 0 Qmj21193
R130 N038 Vo2 0.1
R131 Vo2 N068 0.1
R132 N037 Vo2 0.1
R133 Vo2 N067 0.1
R134 +60V N078 24k
R135 N078 -60V 390
Q78 N051 N078 N090 0 QTIP41C
R136 N090 -60V 120
J3 N052 -60V N080 LSK489B
R137 N080 -60V 82
Q79 N051 N009 N013 0 2SA1579
R139 +60V N013 100
C16 N052 N050 1n Rser=0.1
Q80 +60V N015 N017 0 Qmj21194
Q81 +60V N017 N020 0 Qmj21194
Q82 +60V N020 N030 0 Qmj21194
Q83 +60V N020 N029 0 Qmj21194
Q84 +60V N020 N028 0 Qmj21194
Q85 -60V N044 N081 0 Qmj21193
Q86 -60V N081 N074 0 Qmj21193
Q87 -60V N074 N060 0 Qmj21193
Q88 -60V N074 N059 0 Qmj21193
Q89 -60V N074 N058 0 Qmj21193
R140 N028 Vo1 0.1
R141 Vo1 N058 0.1
R142 N029 Vo1 0.1
R143 N030 Vo1 0.1
R144 Vo1 N059 0.1
R145 Vo1 N060 0.1
R146 N020 N074 180
R147 N017 N081 400
Q90 N040 N042 N044 0 BC547C
R148 N015 N042 620
R149 N042 N044 100
R150 N015 N040 1k
Q91 N044 N040 N015 0 BC857C
R151 N044 -60V 20k
Q92 N015 N009 N007 0 2SA1579
R153 +60V N007 100
Q93 +60V N020 N027 0 Qmj21194
Q94 +60V N020 N026 0 Qmj21194
Q95 -60V N074 N057 0 Qmj21193
Q96 -60V N074 N056 0 Qmj21193
R154 N026 Vo1 0.1
R155 Vo1 N056 0.1
R156 N027 Vo1 0.1
R157 Vo1 N057 0.1
Q97 +60V N020 N025 0 Qmj21194
Q98 -60V N074 N055 0 Qmj21193
R158 N025 Vo1 0.1
R159 Vo1 N055 0.1
Q99 +60V N020 N024 0 Qmj21194
Q100 +60V N020 N023 0 Qmj21194
Q101 -60V N074 N054 0 Qmj21193
Q102 -60V N074 N053 0 Qmj21193
R160 N023 Vo1 0.1
R161 Vo1 N053 0.1
R162 N024 Vo1 0.1
R163 Vo1 N054 0.1
R164 +60V N069 24k
R165 N069 -60V 390
Q103 N044 N069 N082 0 QTIP41C
R166 N082 -60V 120
J4 N044 -60V N073 LSK489B
R167 N073 -60V 82
Q104 N044 N009 N014 0 2SA1579
C17 N044 N045 1n Rser=0.1
V4 N003 0 SINE(0 0.5 1k) AC 0.5
C21 N004 N003 156n Rser=0.1
R173 N004 0 51k
R172 Vo2 Vo1 8
R1 +60V +15V 1k2
R2 +60V +15V 1k2
R3 +60V +15V 1k2
R4 -60V -15V 1k2
R5 -60V -15V 1k2
R7 -60V -15V 1k2
D1 0 +15V BZX84C15VL
D2 -15V 0 BZX84C15VL
R13 N052 N051 0.01
D19 N039 -15V 1N4148
D20 N018 N039 1N4148
Q9 N012 N018 N022 0 BC547C
R30 N022 -15V 68
R31 +15V N018 5700
R8 +60V N075 24k
R9 N075 -60V 390
Q1 N048 N075 N087 0 BC547C
R10 N087 -60V 120
R14 +60V N076 24k
R15 N076 -60V 390
Q3 N049 N076 N088 0 BC547C
R16 N088 -60V 120
R32 +60V N077 24k
R33 N077 -60V 390
Q10 N050 N077 N089 0 BC547C
R34 N089 -60V 120
R42 Vo2 N005 470k
R43 0 N005 4k7
R11 +60V N048 5900
R17 +60V N049 5900
R19 +60V N050 5900
R28 +60V N014 100
C13 N049 N050 12n Rser=0.1
C8 N050 N078 100µ Rser=0.1
C15 N069 N045 100µ Rser=0.1
C9 N075 N002 1µ
C10 N076 N048 10µ
C12 N077 N049 15µ
R29 +60V N072 24k
R35 N072 -60V 390
Q2 N047 N072 N085 0 BC547C
R36 N085 -60V 120
R40 +60V N071 24k
R41 N071 -60V 390
Q4 N046 N071 N084 0 BC547C
R44 N084 -60V 120
R45 +60V N070 24k
R46 N070 -60V 390
Q6 N045 N070 N083 0 QTIP41C
R47 N083 -60V 120
R48 +60V N047 5900
R49 +60V N046 5900
R50 +60V N045 5900
C4 N046 N045 12n Rser=0.1
C5 N072 N001 1µ
C7 N071 N047 10µ
C11 N070 N046 15µ
R12 +60V N014 330
R20 +60V N013 330
.model D D
.lib standard.dio
.model NPN NPN
.model PNP PNP
.lib standard.bjt
.model NJF NJF
.model PJF PJF
.lib standard.jft
.inc 'TL084.301'
.inc 'TIP41C.LIB'
.inc 'TIP42C.LIB'
.inc 'MJ21194.LIB'
.inc 'MJ21193.LIB'
.inc 'MPSA42.LIB'
.inc 'MJE350.LIB'
.inc 'BZX84C15VL.LIB'
.tran 0 15m 14m
;.ac dec 500 0.01 100meg
.fourier 1000 V(Vo1,Vo2)
.fourier 1000 V(Vo1)
.fourier 1000 V(Vo2)
;.step dec param C 500n 100u 15
.backanno
.end